# EAGLE design Adafruit Terminal FeatherWing (EAGLE 6.4)
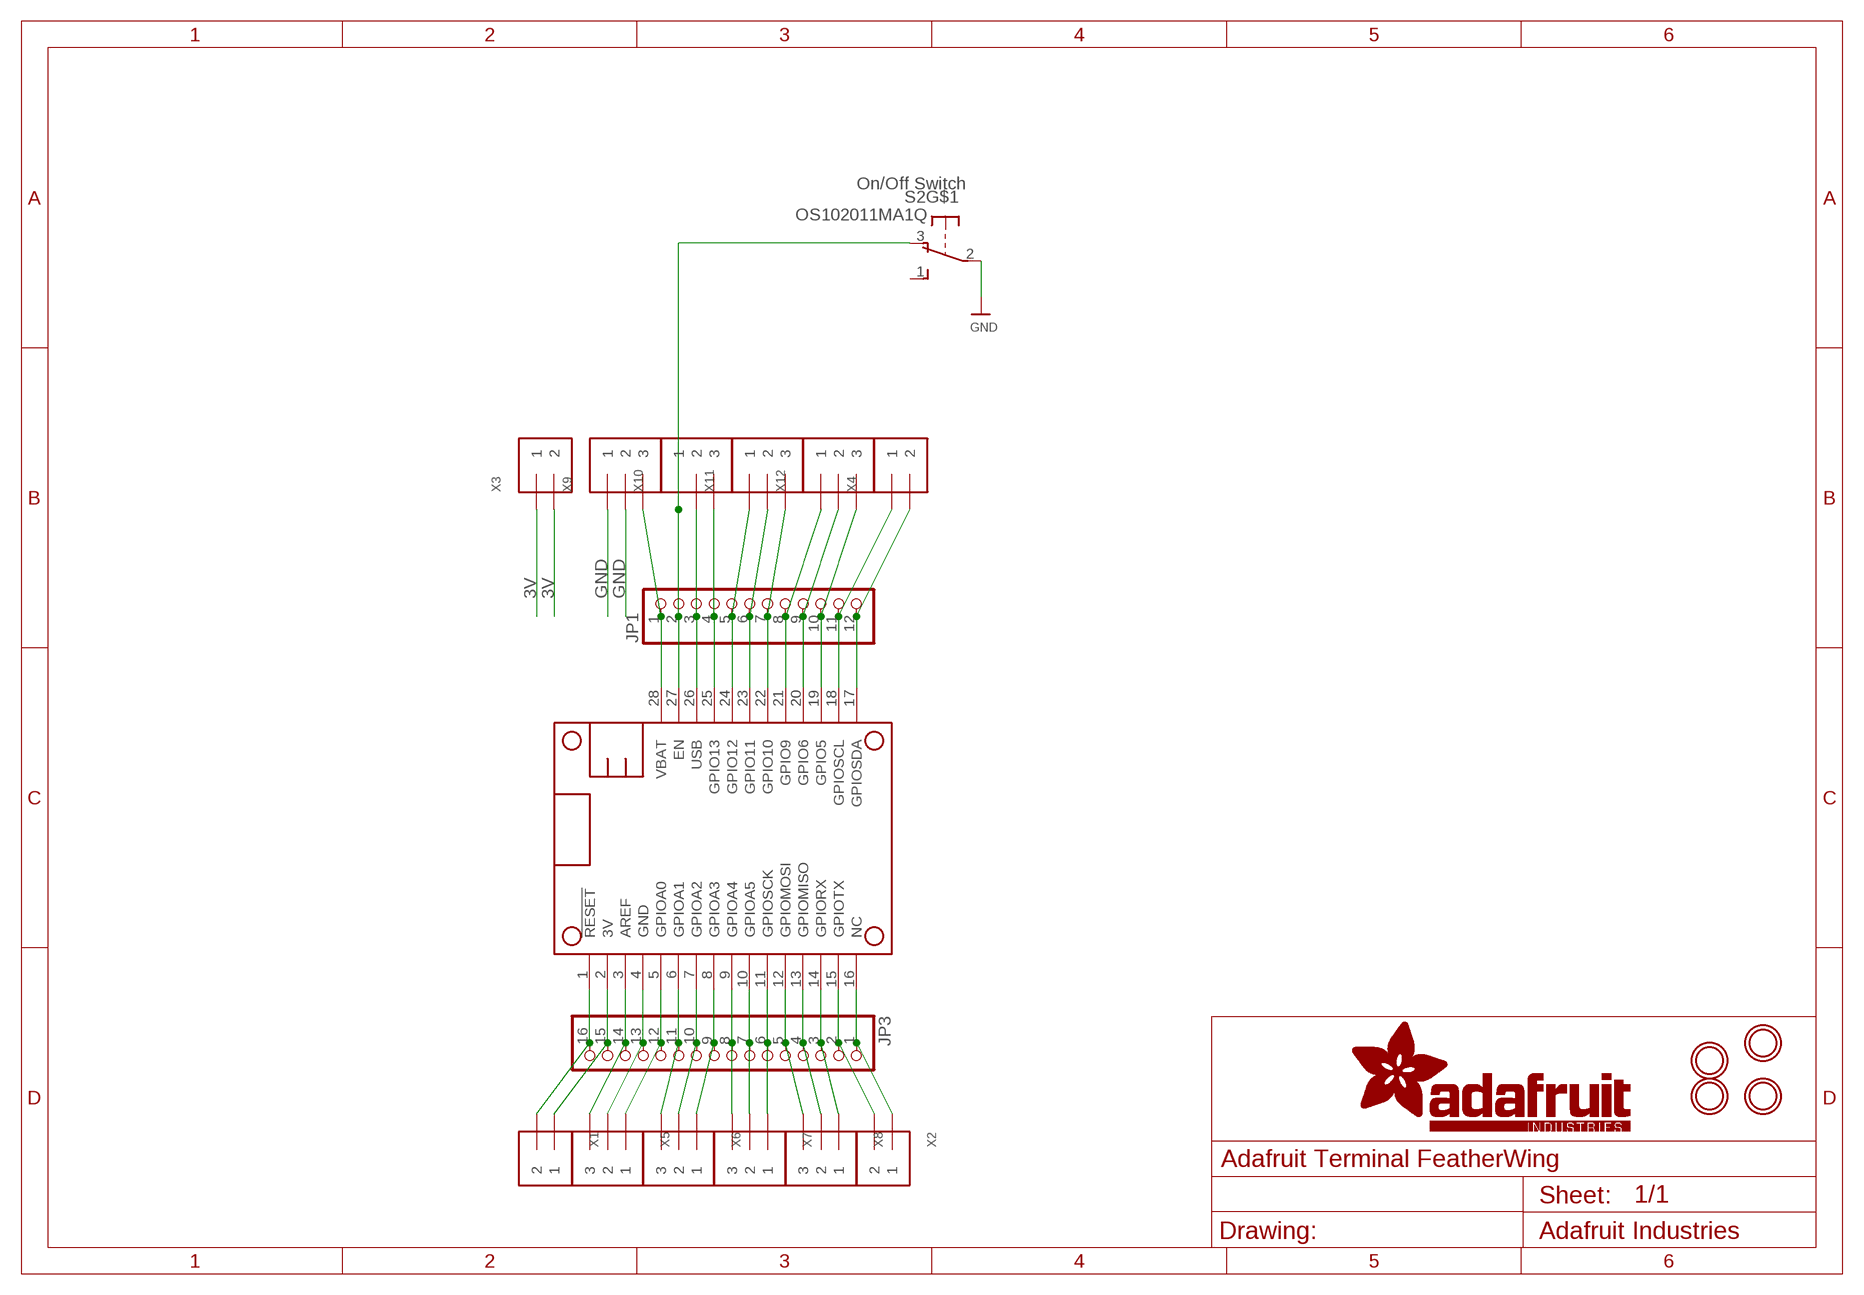
[diagram p0: schematic, sheet 1]

## Parts
JP1  HEADER-1X1276MIL  [1X12_ROUND_76MIL]
JP3  HEADER-1X16_76MIL  [1X16_ROUND_76MIL]
MS1  FEATHERWING_NODIM  [FEATHERWING_DIM]
S2  OS102011MA1Q  [OS102011MA1Q]
U$2  MOUNTINGHOLE3.0THIN  [MOUNTINGHOLE_3.0_PLATEDTHIN]
U$3  MOUNTINGHOLE3.0THIN  [MOUNTINGHOLE_3.0_PLATEDTHIN]
U$4  MOUNTINGHOLE3.0THIN  [MOUNTINGHOLE_3.0_PLATEDTHIN]
U$5  MOUNTINGHOLE3.0THIN  [MOUNTINGHOLE_3.0_PLATEDTHIN]
X1  TERMBLOCK_1X2  [TERMBLOCK_1X2-3.5MM]
X2  TERMBLOCK_1X2  [TERMBLOCK_1X2-3.5MM]
X3  TERMBLOCK_1X2  [TERMBLOCK_1X2-3.5MM]
X4  TERMBLOCK_1X2  [TERMBLOCK_1X2-3.5MM]
X5  TERMBLOCK_1X3  [TERMBLOCK_1X3-3.5MM]
X6  TERMBLOCK_1X3  [TERMBLOCK_1X3-3.5MM]
X7  TERMBLOCK_1X3  [TERMBLOCK_1X3-3.5MM]
X8  TERMBLOCK_1X3  [TERMBLOCK_1X3-3.5MM]
X9  TERMBLOCK_1X3  [TERMBLOCK_1X3-3.5MM]
X10  TERMBLOCK_1X3  [TERMBLOCK_1X3-3.5MM]
X11  TERMBLOCK_1X3  [TERMBLOCK_1X3-3.5MM]
X12  TERMBLOCK_1X3  [TERMBLOCK_1X3-3.5MM]

## Nets
3V: JP3.15 MS1.2(3V) X1.1 X3.1 X3.2
AREF: JP3.14 MS1.3(AREF) X5.3
ENABLE: JP1.2 MS1.27(EN) S2.3(O) X10.1
GND: JP3.13 MS1.4(GND) S2.2(P) X5.2 X9.1 X9.2
N$2: JP3.1 MS1.16(NC) X2.1
N$3: JP1.4 MS1.25(GPIO13) X10.3
N$4: JP3.2 MS1.15(GPIOTX) X2.2
N$5: JP1.5 MS1.24(GPIO12) X11.1
N$6: JP3.3 MS1.14(GPIORX) X8.1
N$7: JP3.4 MS1.13(GPIOMISO) X8.2
N$8: JP3.5 MS1.12(GPIOMOSI) X8.3
N$9: JP3.6 MS1.11(GPIOSCK) X7.1
N$10: JP3.7 MS1.10(GPIOA5) X7.2
N$11: JP3.8 MS1.9(GPIOA4) X7.3
N$12: JP3.9 MS1.8(GPIOA3) X6.1
N$13: JP3.10 MS1.7(GPIOA2) X6.2
N$14: JP3.11 MS1.6(GPIOA1) X6.3
N$15: JP3.12 MS1.5(GPIOA0) X5.1
N$18: JP3.16 MS1.1(!RESET) X1.2
N$19: JP1.6 MS1.23(GPIO11) X11.2
N$20: JP1.7 MS1.22(GPIO10) X11.3
N$21: JP1.8 MS1.21(GPIO9) X12.1
N$22: JP1.9 MS1.20(GPIO6) X12.2
N$23: JP1.10 MS1.19(GPIO5) X12.3
SCL: JP1.11 MS1.18(GPIOSCL) X4.1
SDA: JP1.12 MS1.17(GPIOSDA) X4.2
USB: JP1.3 MS1.26(USB) X10.2
VBAT: JP1.1 MS1.28(VBAT) X9.3
Unconnected: S2.1(S) S2.MT1(MT) S2.MT2(MT)

## Notes on the sheet
- On/Off Switch

## Library data of the parts
JP1 = microbuilder:HEADER-1X12
JP3 = microbuilder:HEADER-1X16: PIN HEADER
MS1 = microbuilder:FEATHERWING
S2 = adafruit:OS102011MA1Q: OS10201MA1Q through-hole right angle switch http://www.ladyada.net/library/eagle
U$2-U$5 = microbuilder:MOUNTINGHOLE: Mounting Hole For #2 screws (0.086"/2.18mm width, 0.094"/2.4mm hole) use 2.5mm; BOM: EXCLUDE
X1-X4 = microbuilder:TERMBLOCK_1X2: 3.5mm Terminal block http://www.ladyada.net/library/pcb/eaglelibrary.html
X5-X12 = microbuilder:TERMBLOCK_1X3: 3.5mm Terminal block http://www.ladyada.net/library/pcb/eaglelibrary.html

## Board
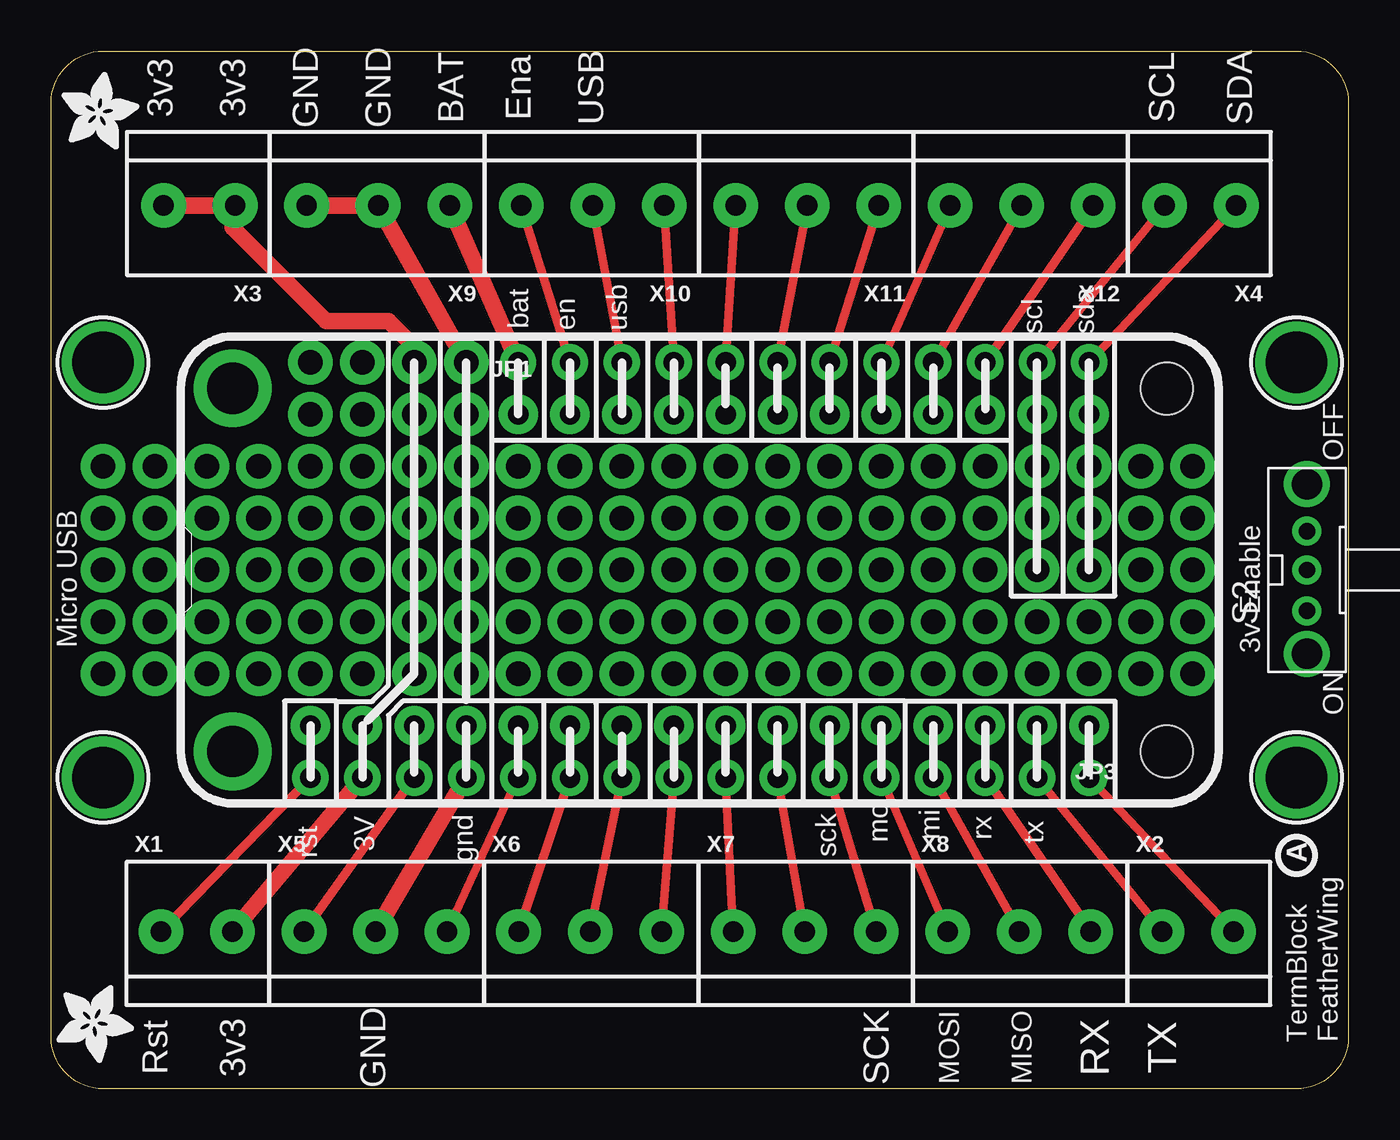
[diagram p1: board, top side]
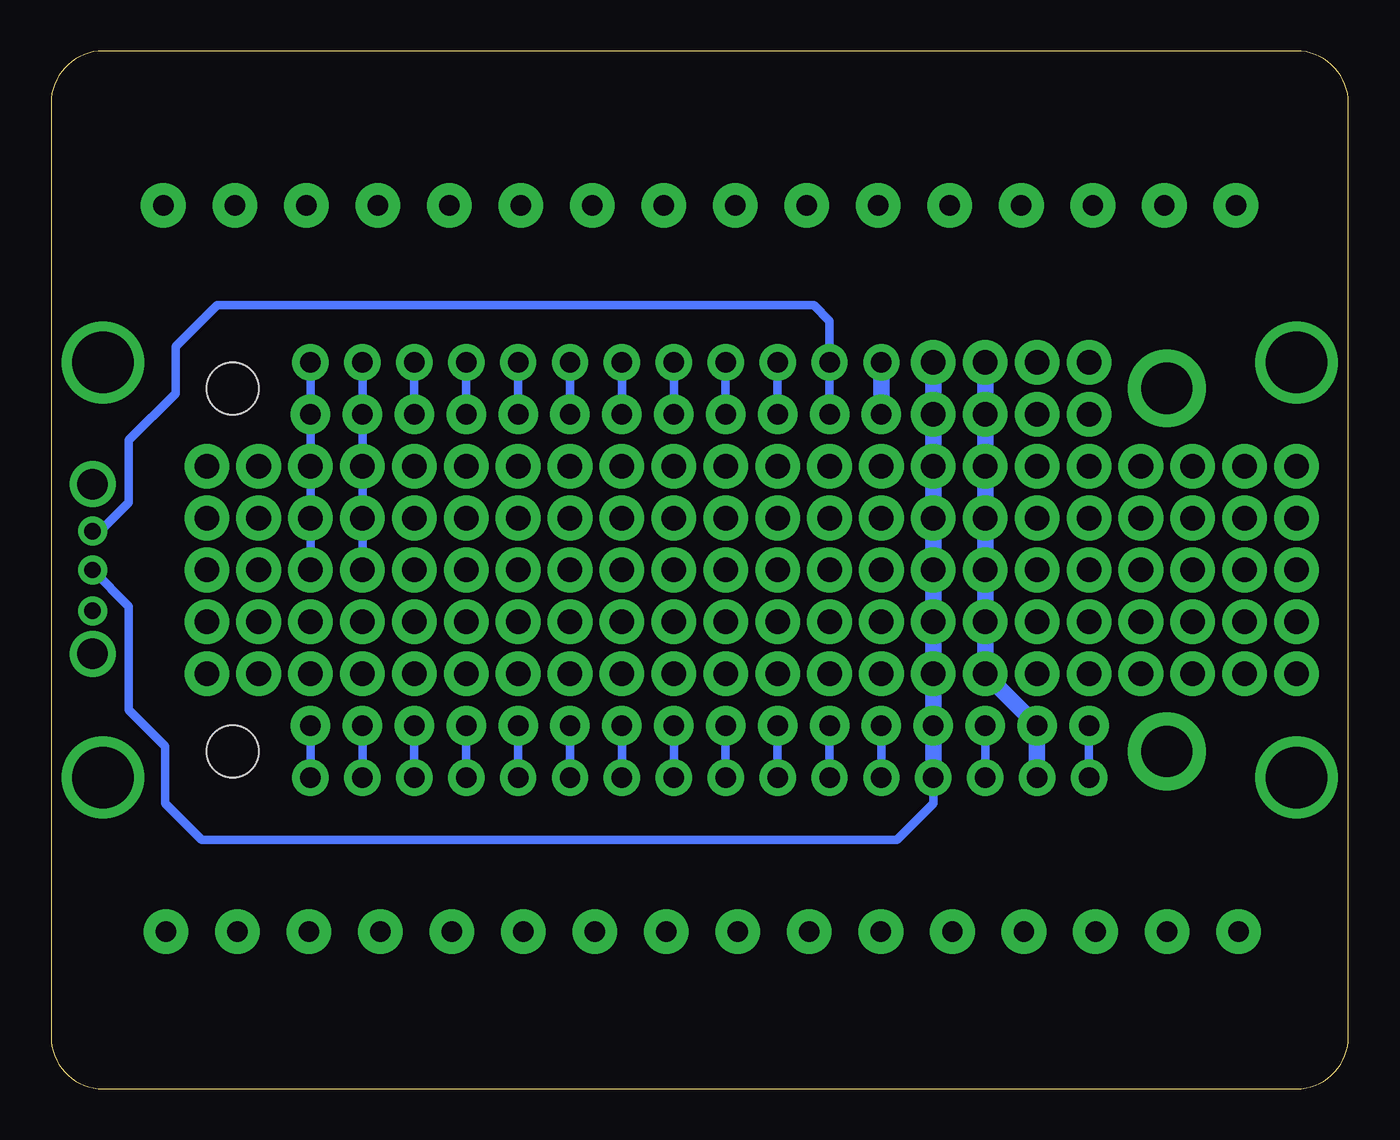
[diagram p2: board, bottom side, seen from below]

Size 63.5 x 50.8 mm. Coordinates in mm from the lower left corner, seen from the top.
Outline: 2.54,50.8 60.96,50.8 arc-90 63.5,48.26 63.5,2.54 arc-90 60.96,0 2.54,0 arc-90 0,2.54 0,48.26 arc-90 2.54,50.8
Copper layers (1*16): Top 0.035mm / dielectric 1.5mm / Bottom 0.035mm
Design rules "adafruit": minimum track width 8mil, minimum drill 15.5mil, track to track 8mil, track to pad 8mil, pad to pad 8mil, via to via 8mil, smd to smd 8mil, copper to edge 10mil, drill to drill 8mil, minimum pad ring 10mil, minimum via ring 8mil, stop-mask expansion 2mil, vias tented up to drill 20mil, thermal gap 10mil

### Footprints (pad centres in the part's own frame; a part is rotated, then mirrored left to right if it is on the bottom)
1X12_ROUND_76MIL = drill 1 pad 1.93: 1 -13.97,0; 2 -11.43,0; 3 -8.89,0; 4 -6.35,0; 5 -3.81,0; 6 -1.27,0; 7 1.27,0; 8 3.81,0; 9 6.35,0; 10 8.89,0; 11 11.43,0; 12 13.97,0
1X16_ROUND_76MIL = drill 1 pad 1.93: 1 -19.05,0; 2 -16.51,0; 3 -13.97,0; 4 -11.43,0; 5 -8.89,0; 6 -6.35,0; 7 -3.81,0; 8 -1.27,0; 9 1.27,0; 10 3.81,0; 11 6.35,0; 12 8.89,0; 13 11.43,0; 14 13.97,0; 15 16.51,0; 16 19.05,0
FEATHERWING_DIM = drill 1 pad 1.778: 1 6.35,1.27; 2 8.89,1.27; 3 11.43,1.27; 4 13.97,1.27; 5 16.51,1.27; 6 19.05,1.27; 7 21.59,1.27; 8 24.13,1.27; 9 26.67,1.27; 10 29.21,1.27; 11 31.75,1.27; 12 34.29,1.27; 13 36.83,1.27; 14 39.37,1.27; 15 41.91,1.27; 16 44.45,1.27; 17 44.45,21.59; 18 41.91,21.59; 19 39.37,21.59; 20 36.83,21.59; 21 34.29,21.59; 22 31.75,21.59; 23 29.21,21.59; 24 26.67,21.59; 25 24.13,21.59; 26 21.59,21.59; 27 19.05,21.59; 28 16.51,21.59 | drill 2.5 pad 3.81: P$1 2.54,20.32; P$2 2.54,2.54 | hole 2.54: 48.26,20.32; 48.26,2.54
OS102011MA1Q = drill 0.8 pad 1.422: 1 -2,0; 2 0,0; 3 1.9,0 | drill 1.5 pad 2.184: MT1 -4.1,0; MT2 4.2,0
MOUNTINGHOLE_3.0_PLATEDTHIN = drill 3 pad 3.6: P$1 0,0
TERMBLOCK_1X2-3.5MM = drill 1 pad 2.184: 1 1.8,0; 2 -1.7,0
TERMBLOCK_1X3-3.5MM = drill 1 pad 2.184: 1 3.55,0; 2 0.05,0; 3 -3.45,0

### Placement (x,y rotation side)
JP1  36.83,33.02 0 top
JP3  31.75,17.78 180 top
MS1  6.35,13.97 0 top
S2  61.47,25.4 90 top
U$2  2.54,35.56 0 top
U$3  2.54,15.24 0 top
U$4  60.96,15.24 0 top
U$5  60.96,35.56 0 top
U$6  [PCBFEAT-REV-040]  60.96,11.43 90 top
U$7  [ADAFRUIT_3.5MM]  0.25,5.08 270 top
U$8  [ADAFRUIT_3.5MM]  0.51,45.97 0 top
X1  7.08,7.7 0 top
X2  56.08,7.7 0 top
X3  7.31,43.24 180 top
X4  56.31,43.24 180 top
X5  15.83,7.7 0 top
X6  26.33,7.7 0 top
X7  36.83,7.7 0 top
X8  47.33,7.7 0 top
X9  16.06,43.24 180 top
X10  26.56,43.24 180 top
X11  37.06,43.24 180 top
X12  47.56,43.24 180 top

### Tracks (layer width: path | path; a pad name or v marks a point on that pad's centre or on a via)
3V  (via drill 1.2 pad 2.18)
  Top 0.813: X1.1 MS1.2 | v17.78,35.56 17.78,36.32 16.51,37.59 13.46,37.59 8.89,42.16 X3.2 X3.1
  Bottom 0.813: MS1.2 JP3.15 v17.78,20.32 v17.78,22.86 v17.78,25.4 v17.78,27.94 v17.78,30.48 v17.78,33.02 v17.78,35.56
AREF
  Top 0.406: X5.3 MS1.3
  Bottom 0.406: JP3.14 MS1.3
ENABLE
  Top 0.406: MS1.27 X10.1
  Bottom 0.406: JP1.2 MS1.27 25.4,37.59 26.16,38.35 55.37,38.35 57.4,36.32 57.4,34.04 59.69,31.75 59.69,28.7 61.09,27.3 S2.3
GND  (via drill 1.2 pad 2.18)
  Top 0.406: 12.45,43.3 X9.1
  Top 0.813: X5.2 MS1.4 | v20.32,35.56 X9.2 X9.1
  Bottom 0.406: 20.32,15.49 20.32,13.97 22.1,12.19 56.13,12.19 57.91,13.97 57.91,16.76 59.69,18.54 59.69,23.62 S2.2
  Bottom 0.61: 20.32,15.49 MS1.4
  Bottom 0.813: 20.32,15.49 JP3.13 v20.32,20.32 v20.32,22.86 v20.32,25.4 v20.32,27.94 v20.32,30.48 20.32,31.75 v20.32,33.02 v20.32,35.56
N$2
  Top 0.406: X2.1 MS1.16
  Bottom 0.406: JP3.1 MS1.16
N$3
  Top 0.406: MS1.25 X10.3
  Bottom 0.406: JP1.4 MS1.25
N$4
  Top 0.406: X2.2 MS1.15
  Bottom 0.406: MS1.15 JP3.2
N$5
  Top 0.406: MS1.24 X11.1
  Bottom 0.406: MS1.24 JP1.5
N$6
  Top 0.406: X8.1 MS1.14
  Bottom 0.406: JP3.3 MS1.14
N$7
  Top 0.406: X8.2 MS1.13
  Bottom 0.406: JP3.4 MS1.13
N$8
  Top 0.406: X8.3 MS1.12
  Bottom 0.406: MS1.12 JP3.5
N$9
  Top 0.406: X7.1 MS1.11
  Bottom 0.406: JP3.6 MS1.11
N$10
  Top 0.406: X7.2 MS1.10
  Bottom 0.406: MS1.10 JP3.7
N$11
  Top 0.406: X7.3 MS1.9
  Bottom 0.406: JP3.8 MS1.9
N$12
  Top 0.406: X6.1 MS1.8
  Bottom 0.406: MS1.8 JP3.9
N$13
  Top 0.406: X6.2 MS1.7
  Bottom 0.406: JP3.10 MS1.7
N$14
  Top 0.406: X6.3 MS1.6
  Bottom 0.406: MS1.6 JP3.11
N$15
  Top 0.406: X5.1 MS1.5
  Bottom 0.406: JP3.12 MS1.5
N$16  (via drill 1.2 pad 2.18)
  other vias: 5.08,30.48
N$17  (via drill 1.2 pad 2.18)
  other vias: 2.54,30.48
N$18
  Top 0.406: X1.2 MS1.1
  Bottom 0.406: MS1.1 JP3.16
N$19
  Top 0.406: MS1.23 X11.2
  Bottom 0.406: JP1.6 MS1.23
N$20
  Top 0.406: MS1.22 X11.3
  Bottom 0.406: MS1.22 JP1.7
N$21
  Top 0.406: MS1.21 X12.1
  Bottom 0.406: JP1.8 MS1.21
N$22
  Top 0.406: MS1.20 X12.2
  Bottom 0.406: MS1.20 JP1.9
N$23
  Top 0.406: MS1.19 X12.3
  Bottom 0.406: JP1.10 MS1.19
N$24  (via drill 1.2 pad 2.18)
  other vias: 5.08,27.94
N$25  (via drill 1.2 pad 2.18)
  other vias: 2.54,27.94
N$26  (via drill 1.2 pad 2.18)
  other vias: 5.08,25.4
N$27  (via drill 1.2 pad 2.18)
  other vias: 2.54,25.4
N$28  (via drill 1.2 pad 2.18)
  other vias: 5.08,22.86
N$29  (via drill 1.2 pad 2.18)
  other vias: 2.54,22.86
N$30  (via drill 1.2 pad 2.18)
  other vias: 15.24,35.56
N$31  (via drill 1.2 pad 2.18)
  other vias: 15.24,33.02
N$32  (via drill 1.2 pad 2.18)
  other vias: 12.7,33.02
N$33  (via drill 1.2 pad 2.18)
  other vias: 12.7,35.56
N$34  (via drill 1.2 pad 2.18)
  other vias: 12.7,30.48
N$35  (via drill 1.2 pad 2.18)
  other vias: 10.16,30.48
N$36  (via drill 1.2 pad 2.18)
  other vias: 2.54,20.32
N$37  (via drill 1.2 pad 2.18)
  other vias: 7.62,27.94
N$38  (via drill 1.2 pad 2.18)
  other vias: 10.16,27.94
N$39  (via drill 1.2 pad 2.18)
  other vias: 12.7,27.94
N$40  (via drill 1.2 pad 2.18)
  other vias: 12.7,25.4
N$41  (via drill 1.2 pad 2.18)
  other vias: 10.16,25.4
N$42  (via drill 1.2 pad 2.18)
  other vias: 7.62,25.4
N$43  (via drill 1.2 pad 2.18)
  other vias: 7.62,22.86
N$44  (via drill 1.2 pad 2.18)
  other vias: 10.16,22.86
N$45  (via drill 1.2 pad 2.18)
  other vias: 12.7,22.86
N$46  (via drill 1.2 pad 2.18)
  other vias: 12.7,20.32
N$47  (via drill 1.2 pad 2.18)
  other vias: 10.16,20.32
N$48  (via drill 1.2 pad 2.18)
  other vias: 7.62,20.32
N$49  (via drill 1.2 pad 2.18)
  other vias: 15.24,20.32
N$50  (via drill 1.2 pad 2.18)
  other vias: 15.24,22.86
N$51  (via drill 1.2 pad 2.18)
  other vias: 15.24,25.4
N$52  (via drill 1.2 pad 2.18)
  other vias: 15.24,27.94
N$53  (via drill 1.2 pad 2.18)
  other vias: 15.24,30.48
N$54  (via drill 1.2 pad 2.18)
  other vias: 5.08,20.32
N$55  (via drill 1.2 pad 2.18)
  other vias: 7.62,30.48
N$57  (via drill 1.2 pad 2.18)
  other vias: 55.88,30.48
N$64  (via drill 1.2 pad 2.18)
  other vias: 22.86,30.48
N$65  (via drill 1.2 pad 2.18)
  other vias: 25.4,30.48
N$66  (via drill 1.2 pad 2.18)
  other vias: 27.94,30.48
N$67  (via drill 1.2 pad 2.18)
  other vias: 22.86,27.94
N$68  (via drill 1.2 pad 2.18)
  other vias: 22.86,25.4
N$69  (via drill 1.2 pad 2.18)
  other vias: 22.86,22.86
N$70  (via drill 1.2 pad 2.18)
  other vias: 22.86,20.32
N$71  (via drill 1.2 pad 2.18)
  other vias: 25.4,20.32
N$72  (via drill 1.2 pad 2.18)
  other vias: 25.4,22.86
N$73  (via drill 1.2 pad 2.18)
  other vias: 25.4,25.4
N$74  (via drill 1.2 pad 2.18)
  other vias: 25.4,27.94
N$75  (via drill 1.2 pad 2.18)
  other vias: 27.94,27.94
N$76  (via drill 1.2 pad 2.18)
  other vias: 27.94,25.4
N$77  (via drill 1.2 pad 2.18)
  other vias: 27.94,22.86
N$78  (via drill 1.2 pad 2.18)
  other vias: 27.94,20.32
N$79  (via drill 1.2 pad 2.18)
  other vias: 30.48,20.32
N$80  (via drill 1.2 pad 2.18)
  other vias: 30.48,22.86
N$81  (via drill 1.2 pad 2.18)
  other vias: 30.48,30.48
N$82  (via drill 1.2 pad 2.18)
  other vias: 30.48,27.94
N$83  (via drill 1.2 pad 2.18)
  other vias: 30.48,25.4
N$84  (via drill 1.2 pad 2.18)
  other vias: 33.02,20.32
N$85  (via drill 1.2 pad 2.18)
  other vias: 33.02,22.86
N$86  (via drill 1.2 pad 2.18)
  other vias: 33.02,25.4
N$87  (via drill 1.2 pad 2.18)
  other vias: 33.02,27.94
N$88  (via drill 1.2 pad 2.18)
  other vias: 33.02,30.48
N$89  (via drill 1.2 pad 2.18)
  other vias: 35.56,30.48
N$90  (via drill 1.2 pad 2.18)
  other vias: 35.56,27.94
N$91  (via drill 1.2 pad 2.18)
  other vias: 35.56,25.4
N$92  (via drill 1.2 pad 2.18)
  other vias: 35.56,22.86
N$93  (via drill 1.2 pad 2.18)
  other vias: 35.56,20.32
N$94  (via drill 1.2 pad 2.18)
  other vias: 38.1,20.32
N$95  (via drill 1.2 pad 2.18)
  other vias: 38.1,22.86
N$96  (via drill 1.2 pad 2.18)
  other vias: 38.1,25.4
N$97  (via drill 1.2 pad 2.18)
  other vias: 38.1,27.94
N$98  (via drill 1.2 pad 2.18)
  other vias: 38.1,30.48
N$99  (via drill 1.2 pad 2.18)
  other vias: 40.64,30.48
N$100  (via drill 1.2 pad 2.18)
  other vias: 40.64,27.94
N$101  (via drill 1.2 pad 2.18)
  other vias: 40.64,25.4
N$102  (via drill 1.2 pad 2.18)
  other vias: 40.64,22.86
N$103  (via drill 1.2 pad 2.18)
  other vias: 40.64,20.32
N$104  (via drill 1.2 pad 2.18)
  other vias: 43.18,20.32
N$105  (via drill 1.2 pad 2.18)
  other vias: 43.18,22.86
N$106  (via drill 1.2 pad 2.18)
  other vias: 43.18,25.4
N$107  (via drill 1.2 pad 2.18)
  other vias: 43.18,27.94
N$108  (via drill 1.2 pad 2.18)
  other vias: 43.18,30.48
N$109  (via drill 1.2 pad 2.18)
  other vias: 45.72,30.48
N$110  (via drill 1.2 pad 2.18)
  other vias: 45.72,27.94
N$111  (via drill 1.2 pad 2.18)
  other vias: 45.72,25.4
N$112  (via drill 1.2 pad 2.18)
  other vias: 45.72,22.86
N$113  (via drill 1.2 pad 2.18)
  other vias: 45.72,20.32
N$114  (via drill 1.2 pad 2.18)
  other vias: 48.26,20.32
N$118  (via drill 1.2 pad 2.18)
  other vias: 48.26,22.86
N$119  (via drill 1.2 pad 2.18)
  other vias: 50.8,20.32
N$120  (via drill 1.2 pad 2.18)
  other vias: 50.8,22.86
N$124  (via drill 1.2 pad 2.18)
  other vias: 53.34,30.48
N$126  (via drill 1.2 pad 2.18)
  other vias: 55.88,27.94
N$127  (via drill 1.2 pad 2.18)
  other vias: 55.88,25.4
N$128  (via drill 1.2 pad 2.18)
  other vias: 55.88,22.86
N$129  (via drill 1.2 pad 2.18)
  other vias: 55.88,20.32
N$130  (via drill 1.2 pad 2.18)
  other vias: 53.34,20.32
N$131  (via drill 1.2 pad 2.18)
  other vias: 53.34,22.86
N$132  (via drill 1.2 pad 2.18)
  other vias: 53.34,25.4
N$133  (via drill 1.2 pad 2.18)
  other vias: 53.34,27.94
SCL  (via drill 1.2 pad 2.18)
  Top 0.406: MS1.18 X4.1
  Bottom 0.406: MS1.18 JP1.11 v48.26,30.48 v48.26,27.94 v48.26,25.4
SDA  (via drill 1.2 pad 2.18)
  Top 0.406: MS1.17 X4.2
  Bottom 0.406: MS1.17 JP1.12 v50.8,30.48 v50.8,27.94 v50.8,25.4
USB
  Top 0.406: MS1.26 X10.2
  Bottom 0.406: MS1.26 JP1.3
VBAT
  Top 0.813: MS1.28 X9.3 19.51,43.74
  Bottom 0.813: MS1.28 JP1.1

### Text on the board
tPlace: 3v3 | 3v3 | GND | GND | BAT | Ena | USB | SCL | SDA | bat | en | usb | scl | sda | OFF | Micro USB | 3v Enable | ON | mo | mi | rx | tx | rst | 3V | gnd | sck | Rst | 3v3 | GND | SCK | MOSI | MISO | RX | TX | TermBlock / FeatherWing